# EAGLE design termoDaQ (EAGLE 9.1.3)
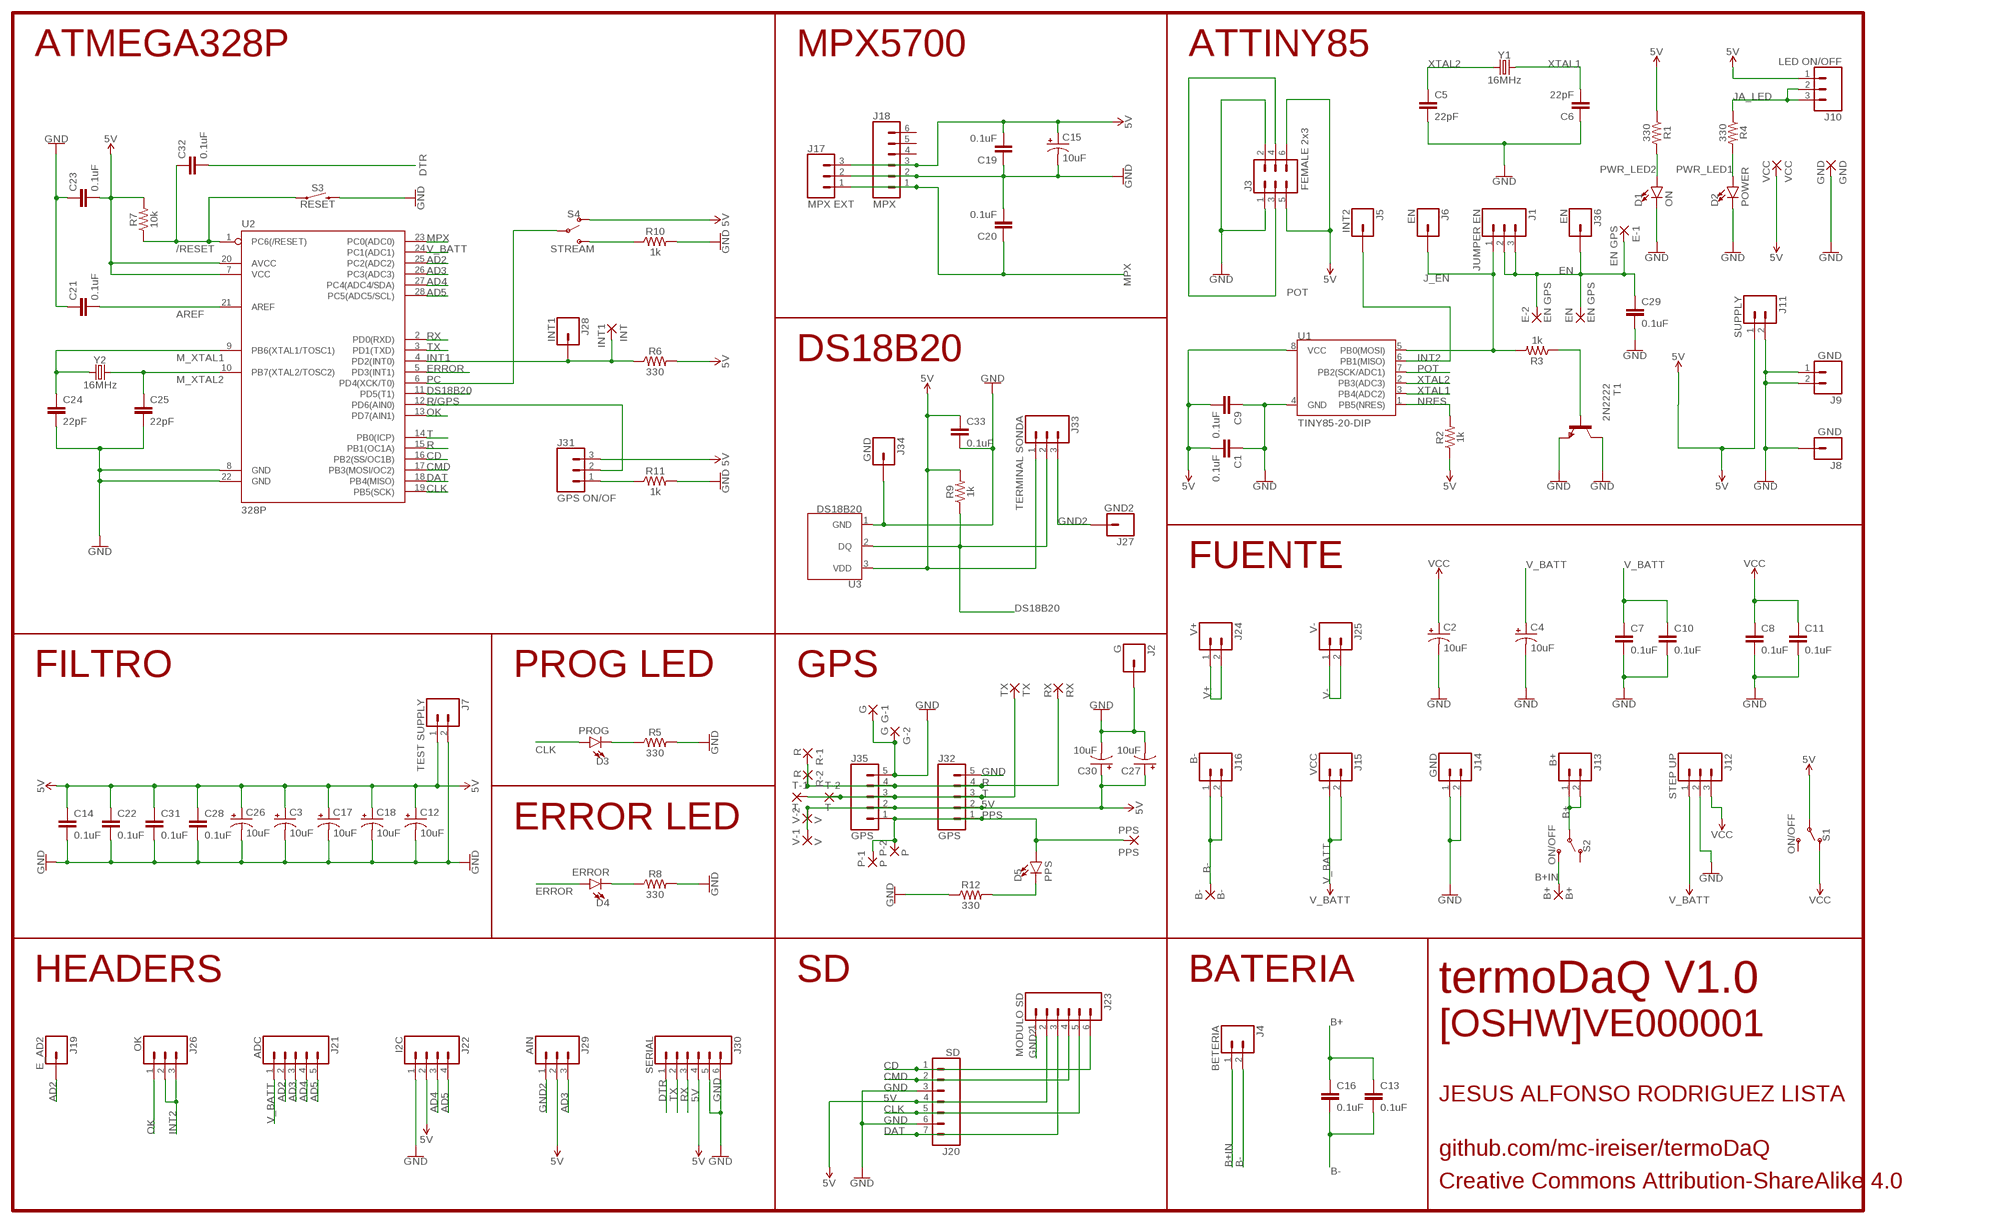
[diagram p0: schematic, sheet 1]

## Parts
B+  B+  SMD5  [SMD2,54-5,08]
B-  B-  SMD5  [SMD2,54-5,08]
C1  0.1uF  0.1UF-KIT-EZ-50V-20%  [CAP-PTH-SMALL-KIT]
C2  10uF  10UF-POLAR-RADIAL-2.5MM-25V-20%  [CPOL-RADIAL-2.5MM-5MM]
C3  10uF  10UF-POLAR-RADIAL-2.5MM-25V-20%  [CPOL-RADIAL-2.5MM-5MM]
C4  10uF  10UF-POLAR-RADIAL-2.5MM-25V-20%  [CPOL-RADIAL-2.5MM-5MM]
C5  22pF  22PF-PTH-2.54MM-200V-5%  [CAP-PTH-2.54]
C6  22pF  22PF-PTH-2.54MM-200V-5%  [CAP-PTH-2.54]
C7  0.1uF  0.1UF-KIT-EZ-50V-20%  [CAP-PTH-SMALL-KIT]
C8  0.1uF  0.1UF-KIT-EZ-50V-20%  [CAP-PTH-SMALL-KIT]
C9  0.1uF  0.1UF-KIT-EZ-50V-20%  [CAP-PTH-SMALL-KIT]
C10  0.1uF  0.1UF-KIT-EZ-50V-20%  [CAP-PTH-SMALL-KIT]
C11  0.1uF  0.1UF-KIT-EZ-50V-20%  [CAP-PTH-SMALL-KIT]
C12  10uF  10UF-POLAR-RADIAL-2.5MM-25V-20%  [CPOL-RADIAL-2.5MM-5MM]
C13  0.1uF  0.1UF-KIT-EZ-50V-20%  [CAP-PTH-SMALL-KIT]
C14  0.1uF  0.1UF-KIT-EZ-50V-20%  [CAP-PTH-SMALL-KIT]
C15  10uF  10UF-POLAR-RADIAL-2.5MM-25V-20%  [CPOL-RADIAL-2.5MM-5MM]
C16  0.1uF  0.1UF-KIT-EZ-50V-20%  [CAP-PTH-SMALL-KIT]
C17  10uF  10UF-POLAR-RADIAL-2.5MM-25V-20%  [CPOL-RADIAL-2.5MM-5MM]
C18  10uF  10UF-POLAR-RADIAL-2.5MM-25V-20%  [CPOL-RADIAL-2.5MM-5MM]
C19  0.1uF  0.1UF-KIT-EZ-50V-20%  [CAP-PTH-SMALL-KIT]
C20  0.1uF  0.1UF-KIT-EZ-50V-20%  [CAP-PTH-SMALL-KIT]
C21  0.1uF  0.1UF-KIT-EZ-50V-20%  [CAP-PTH-SMALL-KIT]
C22  0.1uF  0.1UF-KIT-EZ-50V-20%  [CAP-PTH-SMALL-KIT]
C23  0.1uF  0.1UF-KIT-EZ-50V-20%  [CAP-PTH-SMALL-KIT]
C24  22pF  22PF-PTH-2.54MM-200V-5%  [CAP-PTH-2.54]
C25  22pF  22PF-PTH-2.54MM-200V-5%  [CAP-PTH-2.54]
C26  10uF  10UF-POLAR-RADIAL-2.5MM-25V-20%  [CPOL-RADIAL-2.5MM-5MM]
C27  10uF  10UF-POLAR-RADIAL-2.5MM-25V-20%  [CPOL-RADIAL-2.5MM-5MM]
C28  0.1uF  0.1UF-KIT-EZ-50V-20%  [CAP-PTH-SMALL-KIT]
C29  0.1uF  0.1UF-KIT-EZ-50V-20%  [CAP-PTH-SMALL-KIT]
C30  10uF  10UF-POLAR-RADIAL-2.5MM-25V-20%  [CPOL-RADIAL-2.5MM-5MM]
C31  0.1uF  0.1UF-KIT-EZ-50V-20%  [CAP-PTH-SMALL-KIT]
C32  0.1uF  0.1UF-KIT-EZ-50V-20%  [CAP-PTH-SMALL-KIT]
C33  0.1uF  0.1UF-KIT-EZ-50V-20%  [CAP-PTH-SMALL-KIT]
D1  ON  LED5MM  [LED_5MM]
D2  POWER  LED3MM  [LED_3MM]
D3  PROG  LED5MM  [LED_5MM]
D4  ERROR  LED5MM  [LED_5MM]
D5  PPS  LED5MM  [LED_5MM]
E-1  EN GPS  SMD2  [SMD1,27-2,54]
E-2  EN GPS  SMD2  [SMD1,27-2,54]
EN  EN GPS  SMD2  [SMD1,27-2,54]
G-1  G  SMD2  [SMD1,27-2,54]
G-2  G  SMD2  [SMD1,27-2,54]
GND  GND  SMD2  [SMD1,27-2,54]
INT  INT1  SMD2  [SMD1,27-2,54]
J1  JUMPER EN  CONN_03  [1X03]
J2  G  CONN_01  [1X01]
J3  FEMALE 2x3  CONN_03X2FEMALE  [2X3]
J4  BETERIA  CONN_02  [1X02]
J5  INT2  CONN_01  [1X01]
J6  EN  CONN_01  [1X01]
J7  TEST SUPPLY  CONN_02  [1X02]
J8  GND  CONN_01  [1X01]
J9  GND  CONN_02  [1X02]
J10  LED ON/OFF  CONN_03  [1X03]
J11  SUPPLY  CONN_02  [1X02]
J12  STEP UP  CONN_03  [1X03]
J13  B+  CONN_02  [1X02]
J14  GND  CONN_02  [1X02]
J15  VCC  CONN_02  [1X02]
J16  B-  CONN_02  [1X02]
J17  MPX EXT  CONN_03  [1X03]
J18  MPX  CONN_06SILK_FEMALE_PTH  [1X06]
J19  E_AD2  CONN_01  [1X01]
J20  SD  CONN_07  [1X07]
J21  ADC  CONN_05  [1X05]
J22  I2C  CONN_04  [1X04]
J23  MODULO SD  CONN_06POLAR  [MOLEX-1X6]
J24  V+  CONN_02  [1X02]
J25  V-  CONN_02  [1X02]
J26  OK  CONN_03  [1X03]
J27  GND2  CONN_01  [1X01]
J28  INT1  CONN_01  [1X01]
J29  AIN  CONN_03  [1X03]
J30  SERIAL  CONN_06SILK_FEMALE_PTH  [1X06]
J31  GPS ON/OF  CONN_03  [1X03]
J32  GPS  CONN_05  [1X05]
J33  TERMINAL SONDA  CONN_03-SCREW-5MM  [SCREWTERMINAL-5MM-3]
J34  GND  CONN_01  [1X01]
J35  GPS  CONN_05  [1X05]
J36  EN  CONN_01  [1X01]
P-1  P  SMD2  [SMD1,27-2,54]
P-2  P  SMD2  [SMD1,27-2,54]
PPS  PPS  SMD2  [SMD1,27-2,54]
R1  330  330OHM-HORIZ-1/10W-5%  [AXIAL-0.3]
R2  1k  1KOHM-HORIZ-1/4W-1%  [AXIAL-0.3]
R3  1k  1KOHM-HORIZ-1/4W-1%  [AXIAL-0.3]
R4  330  330OHM-HORIZ-1/10W-5%  [AXIAL-0.3]
R5  330  330OHM-HORIZ-1/10W-5%  [AXIAL-0.3]
R6  330  330OHM-HORIZ-1/10W-5%  [AXIAL-0.3]
R7  10k  10KOHM-HORIZ-1/4W-5%  [AXIAL-0.3]
R8  330  330OHM-HORIZ-1/10W-5%  [AXIAL-0.3]
R9  1k  1KOHM-HORIZ-1/4W-1%  [AXIAL-0.3]
R10  1k  1KOHM-HORIZ-1/4W-1%  [AXIAL-0.3]
R11  1k  1KOHM-HORIZ-1/4W-1%  [AXIAL-0.3]
R12  330  330OHM-HORIZ-1/10W-5%  [AXIAL-0.3]
R-1  R  SMD2  [SMD1,27-2,54]
R-2  R  SMD2  [SMD1,27-2,54]
RX  RX  SMD2  [SMD1,27-2,54]
S1  ON/OFF  SWITCH-SPDT-PTH-11.6X4.0MM  [SWITCH_SPDT_PTH_11.6X4.0MM]
S2  ON/OFF  SWITCH-SPDT-PTH-11.6X4.0MM  [SWITCH_SPDT_PTH_11.6X4.0MM]
S3  RESET  MOMENTARY-SWITCH-SPST-PTH-6.0MM  [TACTILE_SWITCH_PTH_6.0MM]
S4  STREAM  SWITCH-SPDT-PTH-11.6X4.0MM  [SWITCH_SPDT_PTH_11.6X4.0MM]
T1  2N2222  [TO92-EBC-OVAL]
T-1  T  SMD2  [SMD1,27-2,54]
T-2  T  SMD2  [SMD1,27-2,54]
TX  TX  SMD2  [SMD1,27-2,54]
U1  TINY85-20-DIP  ATTINY45TINY85-20-DIP  [DIP08_MCU]
U2  328P  ATMEGA328P_PDIP  [DIP28]
U3  DS18B20  [TO-92-AMMO]
V-1  V  SMD2  [SMD1,27-2,54]
V-2  V  SMD2  [SMD1,27-2,54]
VCC  VCC  SMD2  [SMD1,27-2,54]
Y1  16MHz  CRYSTAL-16MHZPTH-HC49US  [HC49US]
Y2  16MHz  CRYSTAL-16MHZPTH-HC49US  [HC49US]

## Nets
5V: C1.2 C3.1(+) C9.2 C12.1(+) C14.1 C15.1(+) C17.1(+) C18.1(+) C19.2 C22.1 C23.2 C26.1(+) C27.1(+) C28.1 C30.1(+) C31.1 C33.1 J3.5 J3.6 J7.1 J10.1 J11.1 J17.3 J18.3 J20.4 J22.2 J23.2 J29.2 J30.4 J31.3 J32.2 J33.1 J35.2 R1.P$1 R2.P$1 R6.P$2 R7.P$2 R9.P$2 S1.2(P) S4.1(O) U1.8(VCC) U2.7(VCC) U2.20(AVCC) U3.3(VDD) V-1.1(P) V-2.1(P) VCC.1(P)
/RESET: C32.1 R7.P$1 S3.1 U2.1(PC6(/RESET))
AD2: J19.1 J21.2 U2.25(PC2(ADC2))
AD3: J21.3 J29.3 U2.26(PC3(ADC3))
AD4: J21.4 J22.3 U2.27(PC4(ADC4/SDA))
AD5: J21.5 J22.4 U2.28(PC5(ADC5/SCL))
AREF: C21.2 U2.21(AREF)
B+: C13.1 C16.1 J13.1 J13.2 S2.2(P)
B+IN: B+.1(P) J4.1 S2.3(S)
B-: B-.1(P) C13.2 C16.2 J4.2 J16.1 J16.2
CD: J20.1 J23.6 U2.16(PB2(SS/OC1B))
CLK: D3.A J20.5 J23.5 U2.19(PB5(SCK))
CMD: J20.2 J23.4 U2.17(PB3(MOSI/OC2))
DAT: J20.7 J23.3 U2.18(PB4(MISO))
DS18B20: J33.2 R9.P$1 U2.11(PD5(T1)) U3.2(DQ)
DTR: C32.2 J30.1
EN: C29.1 E-1.1(P) E-2.1(P) EN.1(P) J1.2 J1.3 J36.1
ERROR: D4.A U2.5(PD3(INT1))
GND: C1.1 C2.2(-) C3.2(-) C4.2(-) C5.2 C6.1 C7.2 C8.2 C9.1 C10.2 C11.2 C12.2(-) C14.2 C15.2(-) C17.2(-) C18.2(-) C19.1 C20.2 C21.1 C22.2 C23.1 C24.2 C25.2 C26.2(-) C27.2(-) C28.2 C29.2 C30.2(-) C31.2 C33.2 D1.K(C) D2.K(C) G-1.1(P) G-2.1(P) GND.1(P) J2.1 J3.1 J3.2 J7.2 J8.1 J9.1 J9.2 J11.2 J12.2 J14.1 J14.2 J17.2 J18.2 J20.3 J20.6 J22.1 J30.5 J30.6 J32.5 J34.1 J35.5 R5.P$2 R8.P$2 R10.P$2 R11.P$2 R12.P$1 S3.3 T1.C T1.E U1.4(GND) U2.8(GND) U2.22(GND) U3.1(GND)
GND2: J23.1 J27.1 J29.1 J33.3
INT1: INT.1(P) J28.1 R6.P$1 U2.4(PD2(INT0))
INT2: J5.1 J26.2 J26.3 U1.6(PB1(MISO))
J_EN: J1.1 J6.1 R3.P$2 U1.5(PB0(MOSI))
JA_LED: J10.2 J10.3 R4.P$1
M_XTAL1: C24.1 U2.9(PB6(XTAL1/TOSC1)) Y2.1
M_XTAL2: C25.1 U2.10(PB7(XTAL2/TOSC2)) Y2.2
MPX: C20.1 J17.1 J18.1 U2.23(PC0(ADC0))
N$5: D3.K(C) R5.P$1
N$8: D5.K(C) R12.P$2
N$12: D4.K(C) R8.P$1
N$16: J31.1 R11.P$1
N$17: R10.P$1 S4.3(S)
N$20: R3.P$1 T1.B
NRES: R2.P$2 U1.1(PB5(NRES))
OK: J26.1 U2.13(PD7(AIN1))
PC: S4.2(P) U2.6(PD4(XCK/T0))
POT: J3.3 J3.4 U1.7(PB2(SCK/ADC1))
PPS: D5.A J32.1 J35.1 P-1.1(P) P-2.1(P) PPS.1(P)
PWR_LED1: D2.A R4.P$2
PWR_LED2: D1.A R1.P$2
R: J32.4 J35.4 R-1.1(P) R-2.1(P) RX.1(P) U2.15(PB1(OC1A))
R/GPS: J31.2 U2.12(PD6(AIN0))
RX: J30.3 U2.2(PD0(RXD))
T: J32.3 J35.3 T-1.1(P) T-2.1(P) TX.1(P) U2.14(PB0(ICP))
TX: J30.2 U2.3(PD1(TXD))
V+: J24.1 J24.2
V-: J25.1 J25.2
V_BATT: C4.1(+) C7.1 C10.1 J12.1 J15.1 J15.2 J21.1 U2.24(PC1(ADC1))
VCC: C2.1(+) C8.1 C11.1 J12.3 S1.1(O)
XTAL1: C6.2 U1.3(PB4(ADC2)) Y1.2
XTAL2: C5.1 U1.2(PB3(ADC3)) Y1.1
Unconnected: J18.4 J18.5 J18.6 S1.3(S) S2.1(O)

## Notes on the sheet
- ATMEGA328P | MPX5700 | ATTINY85
- DS18B20
- FUENTE
- FILTRO | PROG LED | GPS
- ERROR LED
- HEADERS | SD | BATERIA | termoDaQ V1.0
- [OSHW]VE000001
- JESUS ALFONSO RODRIGUEZ LISTA
- github.com/mc-ireiser/termoDaQ
- Creative Commons Attribution-ShareAlike 4.0

## Library data of the parts
B+ B- = wirepad:SMD5: SMD PAD
C1 C7-C11 C13 C14 C16 C19-C23 C28 C29 C31-C33 = SparkFun-Capacitors:0.1UF: 0.1µF ceramic capacitors A capacitor is a passive two-terminal electrical component used to store electrical energy temporarily in an electric field.; PROD_ID: CAP-08370
C2-C4 C12 C15 C17 C18 C26 C27 C30 = SparkFun-Capacitors:10UF-POLAR: 10.0µF polarized capacitors A capacitor is a passive two-terminal electrical component used to store electrical energy temporarily in an electric field.; PROD_ID: CAP-08440
C5 C6 C24 C25 = SparkFun-Capacitors:22PF: 22pF ceramic capacitors A capacitor is a passive two-terminal electrical component used to store electrical energy temporarily in an electric field.; PROD_ID: CAP-09128
D1 D3-D5 = SparkFun-LED:LED: LED (Generic) Standard schematic elements and footprints for 5mm, 3mm, 1206, and 0603 sized LEDs. Generic LEDs with no color specified.
D2 = SparkFun-LED:LED: LED (Generic) Standard schematic elements and footprints for 5mm, 3mm, 1206, and 0603 sized LEDs. Generic LEDs with no color specified.; PROD_ID: DIO-08794
E-1 E-2 EN G-1 G-2 GND INT P-1 P-2 PPS R-1 R-2 RX T-1 T-2 TX V-1 V-2 VCC = wirepad:SMD2: SMD PAD
J1 J10 J12 J17 J26 J29 J31 = SparkFun-Connectors:CONN_03: Multi connection point. Often used as Generic Header-pin footprint for 0.1 inch spaced/style header connections On any of the 0.1 inch spaced packages, you can populate with these: Break Away Headers - Straight <https://www.sparkfun.com/products/116> (PRT-00116) Break Away Male Headers - Right Angle <https://www.sparkfun.com/products/553> (PRT-00553) Female Headers <https://www.sparkfun.com/products/115> (PRT-00115) Break Away Headers - Machine Pin <https://www.sparkfun.com/products/117> (PRT-00117) Break Away Female Headers - Swiss Machine Pin <https://www.sparkfun.com/products/743> (PRT-00743) Stackable Header - 3 Pin (Female, 0.1") <https://www.sparkfun.com/products/13875> (PRT-13875) For SCREWTERMINALS and SPRING TERMINALS visit here: Screw Terimnals on SparkFun.com <https://www.sparkfun.com/search/results?term=Screw+Terminals> (5mm/3.5mm/2.54mm spacing) This device is also useful as a general connection point to wire up your design to another part of your project. Our various solder wires solder well into these plated through hole pads. Hook-Up Wire - Assortment (Stranded, 22 AWG) <https://www.sparkfun.com/products/11375> (PRT-11375) Hook-Up Wire - Assortment (Solid Core, 22 AWG) <https://www.sparkfun.com/products/11367> (PRT-11367) View the entire wire category on our website here <https://www.sparkfun.com/categories/141> Special notes: Molex polarized connector foot print use with SKU : PRT-08232 with associated crimp pins and housings.
J2 J5 J6 J8 J19 J27 J28 J34 J36 = SparkFun-Connectors:CONN_01: Single connection point. Often used as Generic Header-pin footprint for 0.1 inch spaced/style header connections On any of the 0.1 inch spaced packages, you can populate with these: Break Away Headers - Straight <https://www.sparkfun.com/products/116> (PRT-00116) Break Away Male Headers - Right Angle <https://www.sparkfun.com/products/553> (PRT-00553) Female Headers <https://www.sparkfun.com/products/115> (PRT-00115) Break Away Headers - Machine Pin <https://www.sparkfun.com/products/117> (PRT-00117) Break Away Female Headers - Swiss Machine Pin <https://www.sparkfun.com/products/743> (PRT-00743) This device is also useful as a general connection point to wire up your design to another part of your project. Our various solder wires solder well into these plated through hole pads. Hook-Up Wire - Assortment (Stranded, 22 AWG) <https://www.sparkfun.com/products/11375> (PRT-11375) Hook-Up Wire - Assortment (Solid Core, 22 AWG) <https://www.sparkfun.com/products/11367> (PRT-11367) View the entire wire category on our website here <https://www.sparkfun.com/categories/141> Special notes: SMTSO-256-ET is a "flush mount" nut for a 4-40 screw. We mostly use this on specialty testbeds; it is a nice way to connect hardware to your PCB at an adjustable hieght. Also note, the SNAP packages are for using a snappable style connector. We sell a baggie of snaps and they are also used on two LilyPad designs: Snap Assortment - 30 pack (male and female) <https://www.sparkfun.com/products/11347> (DEV-11347) LilyPad Arduino SimpleSnap <https://www.sparkfun.com/products/10941> (DEV-10941) LilyPad SimpleSnap Protoboard <https://www.sparkfun.com/products/10940> (DEV-10940)
J3 = SparkFun-Connectors:CONN_03X2: Multi connection point. Often used as Generic Header-pin footprint for 0.1 inch spaced/style header connections You can populate with any combo of single row headers, but if you'd like an exact match, check these: Header - 2x3 (Male, 0.1") <https://www.sparkfun.com/products/12807> (PRT-12807) Header - 2x3 (Female, 0.1") <https://www.sparkfun.com/products/13010> (PRT-13010) 2x3 Pin Shrouded Header <https://www.sparkfun.com/products/10877> (PRT-10877) On any of the 0.1 inch spaced packages, you can populate with these: Break Away Headers - Straight <https://www.sparkfun.com/products/116> (PRT-00116) Break Away Male Headers - Right Angle <https://www.sparkfun.com/products/553> (PRT-00553) Female Headers <https://www.sparkfun.com/products/115> (PRT-00115) Break Away Headers - Machine Pin <https://www.sparkfun.com/products/117> (PRT-00117) Break Away Female Headers - Swiss Machine Pin <https://www.sparkfun.com/products/743> (PRT-00743) Special note: the shrouded connector mates well with our 3x2 ribbon cables: Ribbon Crimp Connector - 6-pin (2x3, Female) <https://www.sparkfun.com/products/10651> (PRT-10651) Ribbon Cable - 6 wire (15ft) <https://www.sparkfun.com/products/10646> (PRT-10646); PROD_ID: CONN-11566
J4 J7 J9 J11 J13-J16 J24 J25 = SparkFun-Connectors:CONN_02: Multi connection point. Often used as Generic Header-pin footprint for 0.1 inch spaced/style header connections On any of the 0.1 inch spaced packages, you can populate with these: Break Away Headers - Straight <https://www.sparkfun.com/products/116> (PRT-00116) Break Away Male Headers - Right Angle <https://www.sparkfun.com/products/553> (PRT-00553) Female Headers <https://www.sparkfun.com/products/115> (PRT-00115) Break Away Headers - Machine Pin <https://www.sparkfun.com/products/117> (PRT-00117) Break Away Female Headers - Swiss Machine Pin <https://www.sparkfun.com/products/743> (PRT-00743) For SCREWTERMINALS and SPRING TERMINALS visit here: Screw Terimnals on SparkFun.com <https://www.sparkfun.com/search/results?term=Screw+Terminals> (5mm/3.5mm/2.54mm spacing) This device is also useful as a general connection point to wire up your design to another part of your project. Our various solder wires solder well into these plated through hole pads. Hook-Up Wire - Assortment (Stranded, 22 AWG) <https://www.sparkfun.com/products/11375> (PRT-11375) Hook-Up Wire - Assortment (Solid Core, 22 AWG) <https://www.sparkfun.com/products/11367> (PRT-11367) View the entire wire category on our website here <https://www.sparkfun.com/categories/141> Special notes: Molex polarized connector foot print use with: PRT-08233 with associated crimp pins and housings. 2.54_SCREWTERM for use with PRT-10571. 3.5mm Screw Terminal footprints for PRT-08084 5mm Screw Terminal footprints for use with PRT-08432
J18 J30 = SparkFun-Connectors:CONN_06: Multi connection point. Often used as Generic Header-pin footprint for 0.1 inch spaced/style header connections On any of the 0.1 inch spaced packages, you can populate with these: Break Away Headers - Straight <https://www.sparkfun.com/products/116> (PRT-00116) Break Away Male Headers - Right Angle <https://www.sparkfun.com/products/553> (PRT-00553) Female Headers <https://www.sparkfun.com/products/115> (PRT-00115) Break Away Headers - Machine Pin <https://www.sparkfun.com/products/117> (PRT-00117) Break Away Female Headers - Swiss Machine Pin <https://www.sparkfun.com/products/743> (PRT-00743) Arduino Stackable Header - 6 Pin <https://www.sparkfun.com/products/9280> (PRT-09280) For SCREWTERMINALS and SPRING TERMINALS visit here: Screw Terimnals on SparkFun.com <https://www.sparkfun.com/search/results?term=Screw+Terminals> (5mm/3.5mm/2.54mm spacing) This device is also useful as a general connection point to wire up your design to another part of your project. Our various solder wires solder well into these plated through hole pads. Hook-Up Wire - Assortment (Stranded, 22 AWG) <https://www.sparkfun.com/products/11375> (PRT-11375) Hook-Up Wire - Assortment (Solid Core, 22 AWG) <https://www.sparkfun.com/products/11367> (PRT-11367) View the entire wire category on our website here <https://www.sparkfun.com/categories/141>; PROD_ID: CONN-08437
J20 = SparkFun-Connectors:CONN_07: Multi connection point. Often used as Generic Header-pin footprint for 0.1 inch spaced/style header connections On any of the 0.1 inch spaced packages, you can populate with these: Break Away Headers - Straight <https://www.sparkfun.com/products/116> (PRT-00116) Break Away Male Headers - Right Angle <https://www.sparkfun.com/products/553> (PRT-00553) Female Headers <https://www.sparkfun.com/products/115> (PRT-00115) Break Away Headers - Machine Pin <https://www.sparkfun.com/products/117> (PRT-00117) Break Away Female Headers - Swiss Machine Pin <https://www.sparkfun.com/products/743> (PRT-00743) For SCREWTERMINALS and SPRING TERMINALS visit here: Screw Terimnals on SparkFun.com <https://www.sparkfun.com/search/results?term=Screw+Terminals> (5mm/3.5mm/2.54mm spacing) This device is also useful as a general connection point to wire up your design to another part of your project. Our various solder wires solder well into these plated through hole pads. Hook-Up Wire - Assortment (Stranded, 22 AWG) <https://www.sparkfun.com/products/11375> (PRT-11375) Hook-Up Wire - Assortment (Solid Core, 22 AWG) <https://www.sparkfun.com/products/11367> (PRT-11367) View the entire wire category on our website here <https://www.sparkfun.com/categories/141> Special notes: Molex polarized connector foot print use with SKU : PRT-08231 with associated crimp pins and housings. 1MM SMD Version SKU: PRT-10208 NOTES ON THE VARIANTS LOCK and LOCK_LONGPADS... This footprint was designed to help hold the alignment of a through-hole component (i.e. 6-pin header) while soldering it into place. You may notice that each hole has been shifted either up or down by 0.005 of an inch from it's more standard position (which is a perfectly straight line). This slight alteration caused the pins (the squares in the middle) to touch the edges of the holes. Because they are alternating, it causes a "brace" to hold the component in place. 0.005 has proven to be the perfect amount of "off-center" position when using our standard breakaway headers. Although looks a little odd when you look at the bare footprint, once you have a header in there, the alteration is very hard to notice. Also,if you push a header all the way into place, it is covered up entirely on the bottom side.
J21 J32 J35 = SparkFun-Connectors:CONN_05: Multi connection point. Often used as Generic Header-pin footprint for 0.1 inch spaced/style header connections On any of the 0.1 inch spaced packages, you can populate with these: Break Away Headers - Straight <https://www.sparkfun.com/products/116> (PRT-00116) Break Away Male Headers - Right Angle <https://www.sparkfun.com/products/553> (PRT-00553) Female Headers <https://www.sparkfun.com/products/115> (PRT-00115) Break Away Headers - Machine Pin <https://www.sparkfun.com/products/117> (PRT-00117) Break Away Female Headers - Swiss Machine Pin <https://www.sparkfun.com/products/743> (PRT-00743) For SCREWTERMINALS and SPRING TERMINALS visit here: Screw Terimnals on SparkFun.com <https://www.sparkfun.com/search/results?term=Screw+Terminals> (5mm/3.5mm/2.54mm spacing) This device is also useful as a general connection point to wire up your design to another part of your project. Our various solder wires solder well into these plated through hole pads. Hook-Up Wire - Assortment (Stranded, 22 AWG) <https://www.sparkfun.com/products/11375> (PRT-11375) Hook-Up Wire - Assortment (Solid Core, 22 AWG) <https://www.sparkfun.com/products/11367> (PRT-11367) View the entire wire category on our website here <https://www.sparkfun.com/categories/141> Special notes: Molex polarized connector foot print use with SKU : PRT-08231 with associated crimp pins and housings. 1MM SMD Version SKU: PRT-10208
J22 = SparkFun-Connectors:CONN_04: Multi connection point. Often used as Generic Header-pin footprint for 0.1 inch spaced/style header connections On any of the 0.1 inch spaced packages, you can populate with these: Break Away Headers - Straight <https://www.sparkfun.com/products/116> (PRT-00116) Break Away Male Headers - Right Angle <https://www.sparkfun.com/products/553> (PRT-00553) Female Headers <https://www.sparkfun.com/products/115> (PRT-00115) Break Away Headers - Machine Pin <https://www.sparkfun.com/products/117> (PRT-00117) Break Away Female Headers - Swiss Machine Pin <https://www.sparkfun.com/products/743> (PRT-00743) For SCREWTERMINALS and SPRING TERMINALS visit here: Screw Terimnals on SparkFun.com <https://www.sparkfun.com/search/results?term=Screw+Terminals> (5mm/3.5mm/2.54mm spacing) This device is also useful as a general connection point to wire up your design to another part of your project. Our various solder wires solder well into these plated through hole pads. Hook-Up Wire - Assortment (Stranded, 22 AWG) <https://www.sparkfun.com/products/11375> (PRT-11375) Hook-Up Wire - Assortment (Solid Core, 22 AWG) <https://www.sparkfun.com/products/11367> (PRT-11367) View the entire wire category on our website here <https://www.sparkfun.com/categories/141> Special notes: Molex polarized connector foot print use with SKU : PRT-08231 with associated crimp pins and housings. 1MM SMD Version SKU: PRT-10208; PROD_ID: CONN-09696
J23 = SparkFun-Connectors:CONN_06: Multi connection point. Often used as Generic Header-pin footprint for 0.1 inch spaced/style header connections On any of the 0.1 inch spaced packages, you can populate with these: Break Away Headers - Straight <https://www.sparkfun.com/products/116> (PRT-00116) Break Away Male Headers - Right Angle <https://www.sparkfun.com/products/553> (PRT-00553) Female Headers <https://www.sparkfun.com/products/115> (PRT-00115) Break Away Headers - Machine Pin <https://www.sparkfun.com/products/117> (PRT-00117) Break Away Female Headers - Swiss Machine Pin <https://www.sparkfun.com/products/743> (PRT-00743) Arduino Stackable Header - 6 Pin <https://www.sparkfun.com/products/9280> (PRT-09280) For SCREWTERMINALS and SPRING TERMINALS visit here: Screw Terimnals on SparkFun.com <https://www.sparkfun.com/search/results?term=Screw+Terminals> (5mm/3.5mm/2.54mm spacing) This device is also useful as a general connection point to wire up your design to another part of your project. Our various solder wires solder well into these plated through hole pads. Hook-Up Wire - Assortment (Stranded, 22 AWG) <https://www.sparkfun.com/products/11375> (PRT-11375) Hook-Up Wire - Assortment (Solid Core, 22 AWG) <https://www.sparkfun.com/products/11367> (PRT-11367) View the entire wire category on our website here <https://www.sparkfun.com/categories/141>
J33 = SparkFun-Connectors:CONN_03: Multi connection point. Often used as Generic Header-pin footprint for 0.1 inch spaced/style header connections On any of the 0.1 inch spaced packages, you can populate with these: Break Away Headers - Straight <https://www.sparkfun.com/products/116> (PRT-00116) Break Away Male Headers - Right Angle <https://www.sparkfun.com/products/553> (PRT-00553) Female Headers <https://www.sparkfun.com/products/115> (PRT-00115) Break Away Headers - Machine Pin <https://www.sparkfun.com/products/117> (PRT-00117) Break Away Female Headers - Swiss Machine Pin <https://www.sparkfun.com/products/743> (PRT-00743) Stackable Header - 3 Pin (Female, 0.1") <https://www.sparkfun.com/products/13875> (PRT-13875) For SCREWTERMINALS and SPRING TERMINALS visit here: Screw Terimnals on SparkFun.com <https://www.sparkfun.com/search/results?term=Screw+Terminals> (5mm/3.5mm/2.54mm spacing) This device is also useful as a general connection point to wire up your design to another part of your project. Our various solder wires solder well into these plated through hole pads. Hook-Up Wire - Assortment (Stranded, 22 AWG) <https://www.sparkfun.com/products/11375> (PRT-11375) Hook-Up Wire - Assortment (Solid Core, 22 AWG) <https://www.sparkfun.com/products/11367> (PRT-11367) View the entire wire category on our website here <https://www.sparkfun.com/categories/141> Special notes: Molex polarized connector foot print use with SKU : PRT-08232 with associated crimp pins and housings.; PROD_ID: CONN-10134; SF_SKU: PRT-08433
R1 R4-R6 R8 R12 = SparkFun-Resistors:330OHM: 330Ω resistor A resistor is a passive two-terminal electrical component that implements electrical resistance as a circuit element. Resistors act to reduce current flow, and, at the same time, act to lower voltage levels within circuits. - Wikipedia; PROD_ID: RES-8371
R2 R3 R9 R11 = SparkFun-Resistors:1KOHM: 1kΩ resistor A resistor is a passive two-terminal electrical component that implements electrical resistance as a circuit element. Resistors act to reduce current flow, and, at the same time, act to lower voltage levels within circuits. - Wikipedia; PROD_ID: RES-12182
R7 = SparkFun-Resistors:10KOHM: 10kΩ resistor A resistor is a passive two-terminal electrical component that implements electrical resistance as a circuit element. Resistors act to reduce current flow, and, at the same time, act to lower voltage levels within circuits. - Wikipedia; PROD_ID: RES-09435
R10 = SparkFun-Resistors:1KOHM: 1kΩ resistor A resistor is a passive two-terminal electrical component that implements electrical resistance as a circuit element. Resistors act to reduce current flow, and, at the same time, act to lower voltage levels within circuits. - Wikipedia; PROD_ID: RES-12182; SPICEPREFIX: R
S1 S2 = SparkFun-Switches:SWITCH-SPDT: Single Pole, Double Throw (SPDT) Switch Single-pole, double-throw (SPDT) switch. Variant Overview SMD-AYZ0202 Surface Mount DPDT Switch <https://www.sparkfun.com/products/597> (COM-00597) Used on e.g. LilyPad Arduino USB - ATmega32U4 Board <https://www.sparkfun.com/products/12049> PTH-11.6X4.0MM SPDT Mini Power Switch <https://www.sparkfun.com/products/102> (COM-00102) Used on e.g. SparkFun Simon Says - Through-Hole Soldering Kit <https://www.sparkfun.com/products/10547> (KIT-10547) PTH-11.6X4.0MM-KIT KIT version of SPDT Mini Power Switch - Simplifies soldering by removing tStop of switch pins - only one side can be soldered. PTH-11.6X4.0MM-LOCK LOCK version of SPDT Mini Power Switch - Offset pins hold switch in place for easier soldering. SMD-RIGHT-ANGLE Surface Mount Right Angle Switch <https://www.sparkfun.com/products/10860> (COM-10860) Used on e.g. SparkFun ESP8266 Thing <https://www.sparkfun.com/products/13231>; PROD_ID: SWCH-08261; SF_SKU: COM-00102
S3 = SparkFun-Switches:MOMENTARY-SWITCH-SPST: Momentary Switch (Pushbutton) - SPST Normally-open (NO) SPST momentary switches (buttons, pushbuttons). Variants PTH-12MM - 12mm square, through-hole Momentary Pushbutton Switch - 12mm Square <https://www.sparkfun.com/products/9190> (COM-09190) PTH-6.0MM, PTH-6.0MM-KIT - 6.0mm square, through-hole Mini Pushbutton Switch <https://www.sparkfun.com/products/97> (COM-00097) KIT package intended for soldering kit's - only one side of pads' copper is exposed. PTH-RIGHT-ANGLE-KIT - Right-angle, through-hole Right Angle Tactile Button <https://www.sparkfun.com/products/10791> - Used on SparkFun BigTime Watch Kit <https://www.sparkfun.com/products/11734> SMD-12MM - 12mm square, surface-mount Tactile Button - SMD (12mm) <https://www.sparkfun.com/products/12993> (COM-12993) Used on SparkFun PicoBoard <https://www.sparkfun.com/products/11888> SMD-4.5MM - 4.5mm Square Trackball Switch Used on SparkFun Blackberry Trackballer Breakout <https://www.sparkfun.com/products/13169> SMD-4.6MMX2.8MM - 4.60mm x 2.80mm, surface mount Used on SparkFun SAMD21 Mini Breakout <https://www.sparkfun.com/products/13664> SMD-5.2MM, SMD-5.2-REDUNDANT - 5.2mm square, surface-mount Mini Pushbutton Switch - SMD <https://www.sparkfun.com/products/8720> (COM-08720) Used on Arduino Pro Mini <https://www.sparkfun.com/products/11114> REDUNDANT package connects both switch circuits together SMD-6.0X3.5MM - 6.0 x 3.5mm, surface mount Momentary Reset Switch SMD <https://www.sparkfun.com/products/8229> (COM-08229) SMD-6.2MM-TALL - 6.2mm square, surface mount Tactile Button - SMD (6mm) <https://www.sparkfun.com/products/12992> Used on SparkFun Digital Sandbox <https://www.sparkfun.com/products/12651> SMD-RIGHT-ANGLE - Right-angle, surface mount Used on SparkFun Block for Intel® Edison - Arduino <https://www.sparkfun.com/products/13036>; PROD_ID: SWCH-08441; SF_SKU: COM-00097
S4 = SparkFun-Switches:SWITCH-SPDT: Single Pole, Double Throw (SPDT) Switch Single-pole, double-throw (SPDT) switch. Variant Overview SMD-AYZ0202 Surface Mount DPDT Switch <https://www.sparkfun.com/products/597> (COM-00597) Used on e.g. LilyPad Arduino USB - ATmega32U4 Board <https://www.sparkfun.com/products/12049> PTH-11.6X4.0MM SPDT Mini Power Switch <https://www.sparkfun.com/products/102> (COM-00102) Used on e.g. SparkFun Simon Says - Through-Hole Soldering Kit <https://www.sparkfun.com/products/10547> (KIT-10547) PTH-11.6X4.0MM-KIT KIT version of SPDT Mini Power Switch - Simplifies soldering by removing tStop of switch pins - only one side can be soldered. PTH-11.6X4.0MM-LOCK LOCK version of SPDT Mini Power Switch - Offset pins hold switch in place for easier soldering. SMD-RIGHT-ANGLE Surface Mount Right Angle Switch <https://www.sparkfun.com/products/10860> (COM-10860) Used on e.g. SparkFun ESP8266 Thing <https://www.sparkfun.com/products/13231>; PROD_ID: SWCH-08261; SF_SKU: COM-00102; SPICEPREFIX: J
T1 = adafruit:2N2222: NPN TRANSISTOR Big oval pads
U1 = SparkFun-Retired:ATTINY45: Atmel 8-pin 2/4/8kB flash uC Retired; PROD_ID: IC-09445
U2 = SparkFun-IC-Microcontroller:ATMEGA328P_PDIP: Atmel 328P Through hole ATMEGA328P uC used in the Arduino 32kb flash, 1k EEPROM, 2k SRAM Datasheet <http://www.sparkfun.com/datasheets/Components/SMD/ATMega328.pdf> SparkFun Products Storefront component: AVR 28 Pin 20MHz 32K 6A/D - ATMega328P <https://www.sparkfun.com/products/9061> (COM-09061) SparkFun Simon Says - Through-Hole Soldering Kit <https://www.sparkfun.com/products/10547> (KIT-10547) SparkFun Learn to Solder - Simon Says <https://www.sparkfun.com/products/13708> (KIT-13708) SparkFun BigTime Watch Kit <https://www.sparkfun.com/products/11734> (KIT-11734) SparkFun ClockIt <https://www.sparkfun.com/products/10930> (KIT-10930) SparkFun Serial Enabled LCD Kit <https://www.sparkfun.com/products/10097> (LCD-10097) SparkFun Simon Tilts - Through Hole Soldering Kit <https://www.sparkfun.com/products/12634> (KIT-12634) SparkFun Frequency Counter Kit <https://www.sparkfun.com/products/10140> (KIT-10140) FabFM Radio Kit <https://www.sparkfun.com/products/11043> (KIT-11043) SparkFun Binary Blaster Kit <https://www.sparkfun.com/products/12037> (KIT-12037) SparkFun Metro-Gnome <https://www.sparkfun.com/products/9236> (KIT-09236) ATmega328 with Arduino Optiboot (Uno) <https://www.sparkfun.com/products/10524> (DEV-10524); PROD_ID: IC-09136
U3 = SparkFun-Sensors:DS18B20: Dallas/Maxim DS18B20 1-Wire Temperature Sensor The DS18B20 reports degrees C with 9 to 12-bit precision, -55C to 125C (+/-0.5C). Each sensor has a unique 64-Bit Serial number etched into it - allows for a huge number of sensors to be used on one data bus. Datasheet <http://datasheets.maximintegrated.com/en/ds/DS18B20.pdf> SparkFun Products One Wire Digital Temperature Sensor - DS18B20 <https://www.sparkfun.com/products/245> (SEN-00245); STORE_ID: SEN-00245
Y1 Y2 = SparkFun-Clocks:CRYSTAL-16MHZ: 16MHz Crystal Digikey Example <http://www.digikey.com/product-search/en?keywords=535-9122-1-ND> Frequency: 16MHz Frequency Stability: ±50ppm Frequency Tolerance: ±20ppm Load Capacitance: 18pF SparkFun Products: Pro Micro -5V/16MHz <https://www.sparkfun.com/products/12640> SparkFun Serial Enabled LCD Kit <https://www.sparkfun.com/products/10097>; PROD_ID: XTAL-08181; SF_ID: COM-00536

## Board
termoDaQ v.1.0 Jesús Rodríguez [OSHW] VE000001
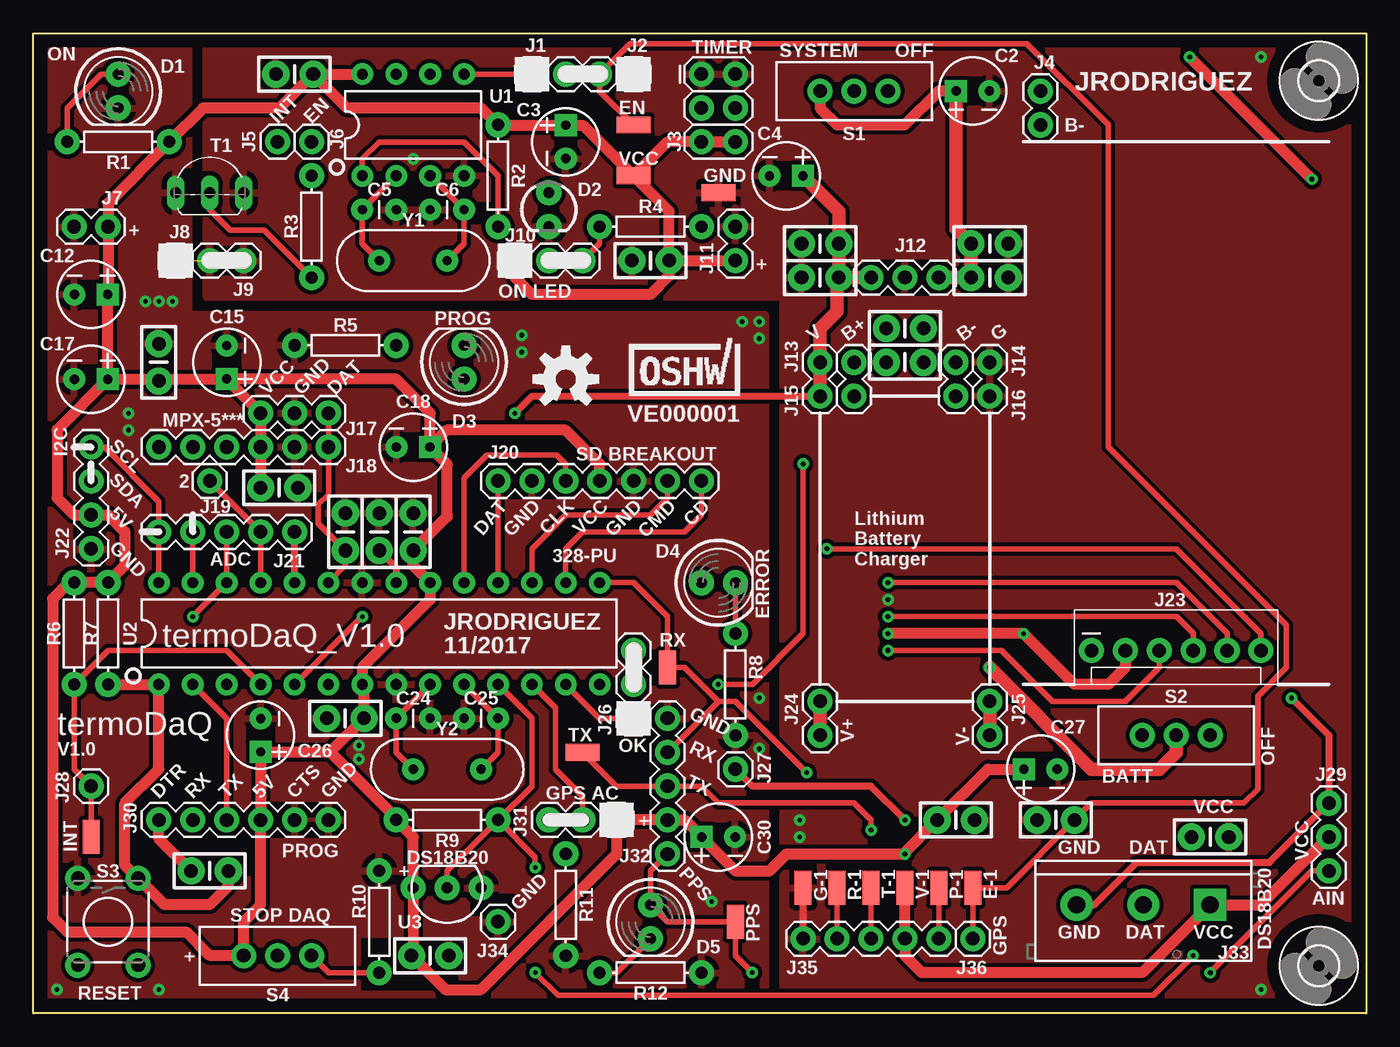
[diagram p1: board, top side]
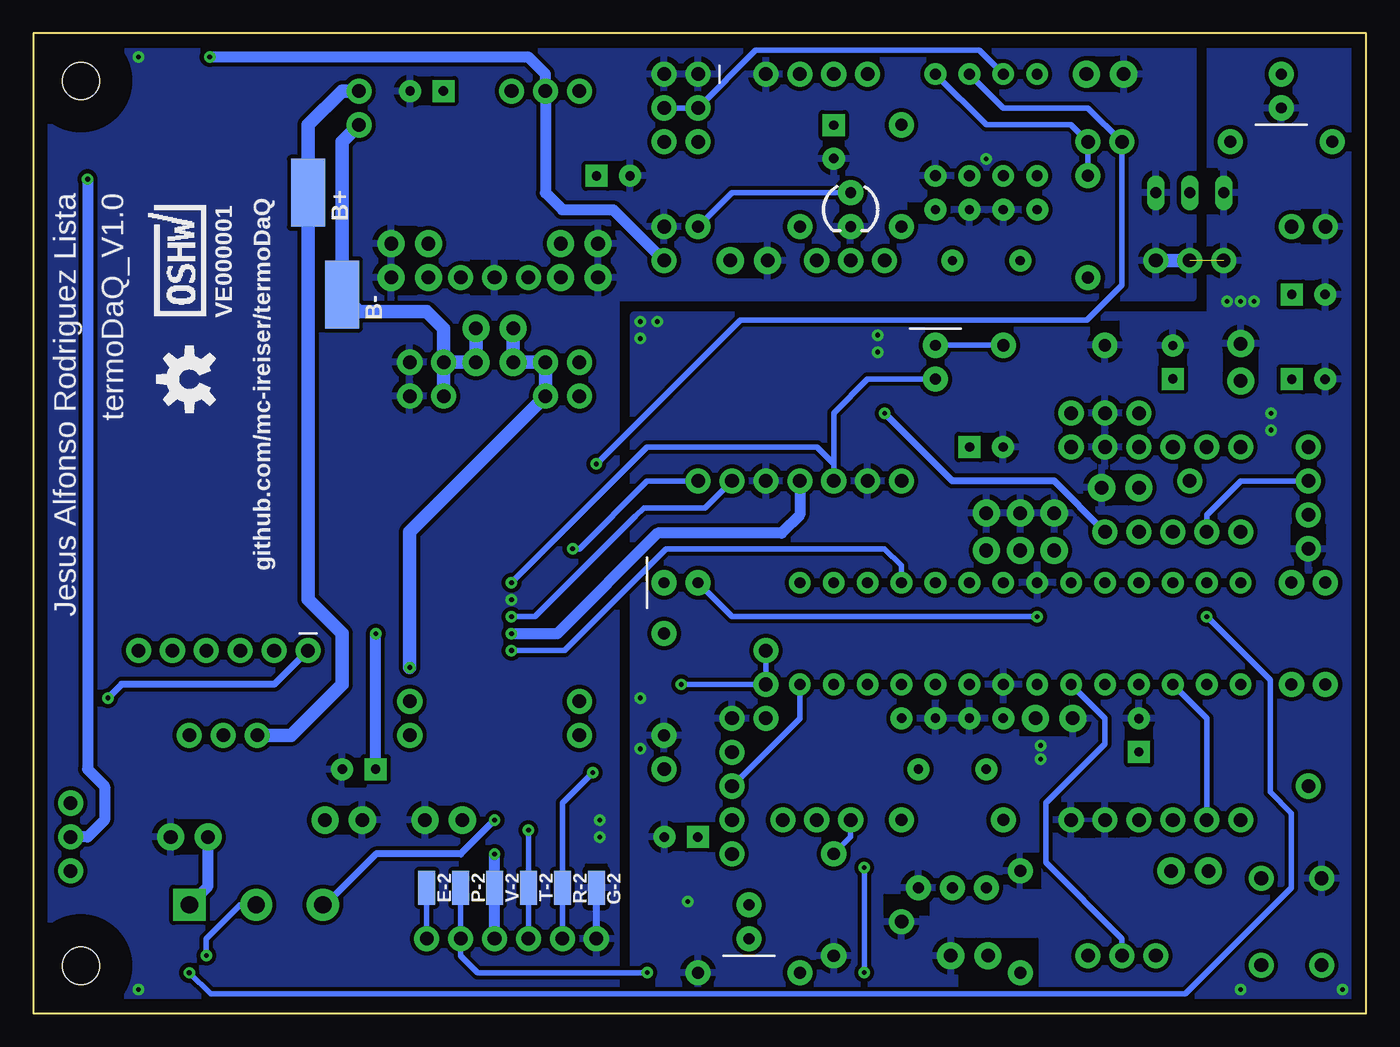
[diagram p2: board, bottom side, seen from below]

Size 99.82 x 73.41 mm. Coordinates in mm from the lower left corner, seen from the top.
Outline: 0,0 0,73.41 99.82,73.41 99.82,0 0,0
Copper layers (1*16): Top 0.035mm / dielectric 1.5mm / Bottom 0.035mm
Design rules "SeeedStudio_2layer_DRU_no_angle_20140221 *": minimum track width 10mil, minimum drill 12mil, track to track 6mil, track to pad 6mil, pad to pad 6mil, via to via 6mil, smd to smd 0mil, copper to edge 10mil, drill to drill 10mil, minimum pad ring 10mil, minimum via ring 10mil, stop-mask expansion 2mil, vias tented up to drill 100mil, thermal gap 16mil

### Footprints (pad centres in the part's own frame; a part is rotated, then mirrored left to right if it is on the bottom)
SMD2,54-5,08 = smd 2.54 x 5.08: 1 0,0
CAP-PTH-SMALL-KIT = drill 1.016 pad 2.032: 1 -1.397,0; 2 1.397,0
CPOL-RADIAL-2.5MM-5MM = drill 0.7 pad 1.651 square: 1 1.25,0 | drill 0.7 pad 1.651: 2 -1.25,0
CAP-PTH-2.54 = drill 0.7 pad 1.651: 1 -1.27,0; 2 1.27,0
LED_5MM = drill 0.813 pad 1.88: A -1.27,0; K 1.27,0
LED_3MM = drill 0.813 pad 1.88: A -1.27,0; K 1.27,0
SMD1,27-2,54 = smd 1.27 x 2.54: 1 0,0
1X03 = drill 1.016 pad 1.88: 1 0,0; 2 2.54,0; 3 5.08,0
1X01 = drill 1.016 pad 1.88: 1 0,0
2X3 = drill 1.016 pad 1.88: 1 0,0; 2 0,2.54; 3 2.54,0; 4 2.54,2.54; 5 5.08,0; 6 5.08,2.54
1X02 = drill 1.016 pad 1.88: 1 0,0; 2 2.54,0
1X06 = drill 1.016 pad 1.88: 1 0,0; 2 2.54,0; 3 5.08,0; 4 7.62,0; 5 10.16,0; 6 12.7,0
1X07 = drill 1.016 pad 1.88: 1 0,0; 2 2.54,0; 3 5.08,0; 4 7.62,0; 5 10.16,0; 6 12.7,0; 7 15.24,0
1X05 = drill 1.016 pad 1.88: 1 0,0; 2 2.54,0; 3 5.08,0; 4 7.62,0; 5 10.16,0
1X04 = drill 1.016 pad 1.88: 1 0,0; 2 2.54,0; 3 5.08,0; 4 7.62,0
MOLEX-1X6 = drill 1.016 pad 1.88: 1 0,0; 2 2.54,0; 3 5.08,0; 4 7.62,0; 5 10.16,0; 6 12.7,0
SCREWTERMINAL-5MM-3 = drill 1.3 pad 2.413 square: 1 0,0 | drill 1.3 pad 2.413: 2 5,0; 3 10,0
AXIAL-0.3 = drill 0.9 pad 1.88: P$1 -3.81,0; P$2 3.81,0
SWITCH_SPDT_PTH_11.6X4.0MM = drill 1.016 pad 1.88: 1 0,2.54; 2 0,0; 3 0,-2.54
TACTILE_SWITCH_PTH_6.0MM = drill 1.016 pad 1.88: 1 -3.251,2.261; 2 3.251,2.261; 3 -3.251,-2.261; 4 3.251,-2.261
TO92-EBC-OVAL = drill 0.813 long: B 0,-1.27; C 2.54,-1.27; E -2.54,-1.27
DIP08_MCU = drill 0.813 pad 1.626: 1 -3.81,-3.81; 2 -1.27,-3.81; 3 1.27,-3.81; 4 3.81,-3.81; 5 3.81,3.81; 6 1.27,3.81; 7 -1.27,3.81; 8 -3.81,3.81
DIP28 = drill 0.813 pad 1.626: 1 -16.51,-3.81; 2 -13.97,-3.81; 3 -11.43,-3.81; 4 -8.89,-3.81; 5 -6.35,-3.81; 6 -3.81,-3.81; 7 -1.27,-3.81; 8 1.27,-3.81; 9 3.81,-3.81; 10 6.35,-3.81; 11 8.89,-3.81; 12 11.43,-3.81; 13 13.97,-3.81; 14 16.51,-3.81; 15 16.51,3.81; 16 13.97,3.81; 17 11.43,3.81; 18 8.89,3.81; 19 6.35,3.81; 20 3.81,3.81; 21 1.27,3.81; 22 -1.27,3.81; 23 -3.81,3.81; 24 -6.35,3.81; 25 -8.89,3.81; 26 -11.43,3.81; 27 -13.97,3.81; 28 -16.51,3.81
TO-92-AMMO = drill 0.813 pad 1.88: 1 -2.54,0; 2 0,0; 3 2.54,0
2,8 = hole 2.8: 0,0
HC49US = drill 0.7 pad 1.651: 1 -2.54,0; 2 2.54,0

### Placement (x,y rotation side)
B+  79.25,61.47 0 bottom
B-  76.71,53.85 0 bottom
C1  19.56,70.36 0 top
C2  70.36,69.09 180 top
C3  39.88,65.28 90 top
C4  56.39,62.74 0 top
C5  25.91,60.2 0 top
C6  30.99,60.2 0 top
C7  58.93,57.66 180 top
C8  71.63,57.66 0 top
C9  46.23,56.39 0 top
C10  58.93,55.12 180 top
C11  71.63,55.12 0 top
C12  4.32,53.85 0 top
C13  65.28,51.31 0 top
C14  9.4,48.77 90 top
C15  14.48,48.77 270 top
C16  65.28,48.77 0 top
C17  4.32,47.5 0 top
C18  28.45,42.42 0 top
C19  18.41,39.37 180 top
C20  23.37,36.07 90 top
C21  25.91,36.07 270 top
C22  28.45,36.07 90 top
C23  23.37,22.1 0 top
C24  28.45,22.1 0 top
C25  33.53,22.1 180 top
C26  17.02,20.83 270 top
C27  75.44,18.29 180 top
C28  69.09,14.48 0 top
C29  76.58,14.48 180 top
C30  51.31,13.21 180 top
C31  88.14,13.21 0 top
C32  13.21,10.67 180 top
C33  29.72,4.32 0 top
D1  6.35,69.09 270 top
D2  38.61,60.2 270 top
D3  32.26,48.77 90 top
D4  51.31,32.26 0 top
D5  46.23,6.86 270 top
E-1  70.36,9.4 180 top
E-2  70.36,9.4 180 bottom
EN  44.96,66.55 270 top
G-1  57.66,9.4 180 top
G-2  57.66,9.4 180 bottom
GND  51.31,61.47 270 top
INT  4.32,13.21 0 top
J1  37.34,70.36 0 top
J2  44.96,70.36 0 top
J3  50.04,70.36 270 top
J4  75.44,69.09 270 top
J5  18.29,65.28 0 top
J6  20.83,65.28 0 top
J7  5.59,58.93 180 top
J8  10.67,56.39 90 top
J9  15.75,56.39 180 top
J10  36.07,56.39 0 top
J11  52.58,56.39 90 top
J12  62.74,55.12 0 top
J13  61.47,48.77 270 top
J14  71.63,48.77 270 top
J15  58.93,46.23 90 top
J16  69.09,46.23 90 top
J17  22.1,44.96 180 top
J18  22.1,42.42 180 top
J19  13.21,39.88 180 top
J20  50.04,39.88 180 top
J21  19.56,36.07 180 top
J22  4.32,34.8 90 top
J23  79.25,27.18 0 top
J24  58.93,23.37 270 top
J25  71.63,23.37 270 top
J26  44.96,22.1 90 top
J27  52.58,18.29 270 top
J28  4.32,17.02 180 top
J29  97.03,15.75 270 top
J30  9.4,14.48 0 top
J31  38.61,14.48 0 top
J32  47.5,11.94 90 top
J33  88.14,8.13 180 top
J34  34.8,6.86 180 top
J35  67.82,5.59 180 top
J36  70.36,5.59 0 top
P-1  67.82,9.4 180 top
P-2  67.82,9.4 180 bottom
PPS  52.58,6.86 180 top
R1  6.35,65.28 180 top
R2  34.8,62.74 270 top
R3  20.83,58.93 90 top
R4  46.23,58.93 0 top
R5  23.37,50.04 180 top
R6  3.05,28.45 90 top
R7  5.59,28.45 90 top
R8  52.58,24.64 270 top
R9  30.99,14.48 180 top
R10  25.91,6.86 90 top
R11  39.88,8.13 270 top
R12  46.23,3.05 180 top
R-1  60.2,9.4 180 top
R-2  60.2,9.4 180 bottom
RX  47.5,25.91 180 top
S1  61.47,69.09 90 top
S2  85.6,20.83 270 top
S3  5.59,6.86 270 top
S4  18.29,4.32 90 top
T1  13.21,62.74 0 top
T-1  62.74,9.4 180 top
T-2  62.74,9.4 180 bottom
TX  41.15,19.56 270 top
U1  28.45,66.55 0 top
U2  25.91,28.45 0 top
U3  30.99,9.4 180 top
U$1  [OSHW-LOGO-M]  39.88,47.5 0 top
U$2  [CERT-SMALL-SILK]  48.77,46.23 0 top
U$3  [2,8]  96.27,69.85 0 top
U$4  [2,8]  96.27,3.56 0 top
U$100  [OSHW-LOGO-M]  88.14,47.5 90 bottom
U$101  [CERT-SMALL-SILK]  86.87,56.39 90 bottom
V-1  65.28,9.4 180 top
V-2  65.28,9.4 180 bottom
VCC  44.96,62.74 270 top
Y1  28.45,56.39 0 top
Y2  30.99,18.29 0 top

### Tracks (layer width: path | path; a pad name or v marks a point on that pad's centre or on a via)
5V  (via drill 0.35)
  Top 0.813: J3.6 J3.5 47.5,65.28 VCC.1 | C17.1 C12.1 5.59,53.87 J7.1 5.59,60.71 R1.P$1 12.7,67.82 18.54,67.82 18.54,67.94 C1.2 | 14.5,47.5 C15.1 | v64.01,28.45 v74.17,28.45 77.98,24.64 80.52,24.64 81.79,25.91 J23.2 | VCC.1 41.17,66.53 C3.1 34.82,66.53 R2.P$1 33.53,67.82 23.5,67.82 C1.2 | C17.1 1.78,43.71 1.78,38.61 3.05,37.34 J22.2 5.59,37.34 6.86,36.07 6.86,33.53 R7.P$2 R6.P$2 2.67,32.26 1.45,31.04 1.45,7.19 2.54,6.1 11.43,6.1 13.21,4.32 S4.1 15.75,6.86 17.02,8.13 J30.4 C26.1 22.25,19.58 | C17.1 9.27,47.5 C14.1 9.53,47.5 14.5,47.5 | C18.1 30.99,41.13 30.99,37.34 30.99,37.21 C22.1 28.45,33.53 U2.20 29.72,30.99 24.64,25.91 U2.7 24.77,24.51 C23.2 22.25,19.58 | C18.1 30.97,43.69 39.88,43.69 42.42,41.15 J20.4 | 14.5,47.5 14.5,47.48 J17.3 J18.3 C19.2 | C27.1 71.5,18.29 C28.1 65.15,11.94 56.39,11.94 55.12,10.67 52.6,10.67 C30.1 48.79,14.48 J32.2 J31.3 43.69,11.94 33.53,1.78 30.86,1.78 C33.1 28.45,4.45 U3.3 28.45,13.21 R9.P$2 27.18,14.64 22.25,19.58 | J29.2 91.95,8.13 J33.1 83.06,3.05 66.55,3.05 65.28,4.32 J35.2 V-1.1 | v95.76,62.48 v86.61,71.63 | C9.2 J11.1 | C1.2 U1.8 | C9.2 47.62,60.07 VCC.1 | C9.2 47.62,55.24 46.23,53.85 37.34,53.85 36.07,55.12 J10.1 | C18.1 29.72,42.44 29.72,44.96 27.18,47.5 14.5,47.5
  Bottom 0.813: v64.01,28.45 60.58,28.45 53.06,35.97 43.79,35.97 42.42,37.34 J20.4 | J35.2 V-1.1 v65.28,11.94 | J33.1 86.74,9.53 C31.1 | v74.17,28.45 74.19,28.43 C27.1 | J29.2 95.76,13.21 94.49,14.48 94.49,17.02 95.76,18.29 v95.76,62.48 | v86.61,71.63 62.74,71.63 61.47,70.36 S1.2 61.47,61.47 60.2,60.2 56.39,60.2 J11.1
/RESET
  Top 0.813: R7.P$1 U2.1 9.4,18.29 6.86,15.75 6.86,11.1 S3.1 9.83,8.13 13.21,8.13 14.61,9.53 C32.1
AD2
  Top 0.406: U2.25 J21.2 J19.1
AD3  (via drill 0.35)
  Top 0.406: J21.3 U2.26 v11.94,29.72 | J29.3 95.76,10.67 88.15,3.06 v88.15,3.04
  Bottom 0.406: 86.56,1.45 86.11,1.45 | 86.11,1.45 13.54,1.45 5.59,9.4 5.59,14.99 7.19,16.59 7.19,18.36 7.19,24.97 v11.94,29.72 | v88.15,3.04 86.56,1.45 | 86.56,1.45 86.11,1.45
AD4
  Top 0.406: U2.27 J21.4
  Bottom 0.406: J21.4 11.94,37.34 9.4,39.88 J22.3
AD5
  Top 0.406: U2.28 J21.5 9.4,38.35 5.33,42.42 J22.4
AREF
  Top 0.508: C21.2 27.18,33.4 U2.21
B+  (via drill 0.35)
  Top 1.016: S2.2 85.6,19.56 84.33,18.29 79.25,18.29 v71.63,25.91
  Bottom 1.016: v71.63,25.91 71.63,36.07 J13.2 J13.1 C16.1 C13.1
B+IN
  Bottom 1.016: J4.1 76.71,69.09 79.25,66.55 B+.1 79.25,30.99 76.71,28.45 76.71,24.64 80.52,20.83 S2.3
B-
  Bottom 1.016: J4.2 76.71,65.28 B-.1 75.44,52.58 73.91,52.58 72.9,52.58 | J16.2 J16.1 | J16.2 C16.2 C13.2 | 72.9,52.58 | 72.9,52.58 70.36,52.58 69.09,51.31 J16.2
CD  (via drill 0.35)
  Top 0.406: v59.44,34.8 85.6,34.8 91.95,28.45 J23.6 | U2.16 39.88,34.8 41.15,36.07 48.77,36.07 50.04,37.34 J20.1
  Bottom 0.406: J20.1 53.85,39.88 58.93,34.8 v59.44,34.8
CLK  (via drill 0.35)
  Top 0.406: J23.5 89.41,28.45 85.6,32.26 v64.01,32.26 | U2.19 32.26,38.61 32.26,39.62 | 32.26,39.62 32.26,39.88 | 32.26,39.88 32.26,40.1 | 32.26,39.88 32.26,39.62 | 32.26,40.1 33.99,41.83 39.19,41.83 39.88,41.15 J20.5 | 32.26,40.1 32.26,39.88
  Bottom 0.406: v64.01,32.26 53.85,42.42 41.15,42.42 39.88,41.15 J20.5 39.88,44.96 37.34,47.5 D3.A
CMD  (via drill 0.35)
  Top 0.406: J23.4 86.87,28.45 85.6,29.72 69.09,29.72 67.82,29.72 65.28,29.72 v64.01,29.72 | U2.17 37.34,34.8 39.88,37.34 46.23,37.34 47.5,38.61 J20.2
  Bottom 0.406: v64.01,29.72 62.23,29.72 54.71,37.24 54.1,37.85 49.53,37.85 J20.2
DAT  (via drill 0.35)
  Top 0.406: J23.3 84.33,25.91 81.79,23.37 76.33,23.37 72.52,27.18 69.09,27.18 67.82,27.18 v64.01,27.18 | U2.18 J20.7
  Bottom 0.406: v64.01,27.18 60.2,27.18 60.05,27.18 52.43,34.8 36.07,34.8 34.8,33.53 U2.18
DS18B20  (via drill 0.35)
  Top 0.406: R9.P$1 37.34,17.02 37.34,19.81 37.34,22.1 U2.11 | v86.87,4.32 83.9,1.35 39.37,1.35 39.29,1.35 v37.59,3.05 | R9.P$1 37.59,11.68 v37.59,10.92 | R9.P$1 30.99,10.67 U3.2
  Bottom 0.406: v37.59,10.92 v37.59,3.05 | v86.87,4.32 86.87,5.59 84.33,8.13 J33.2
DTR
  Top 0.813: C32.2 9.4,13.08 J30.1
EN
  Top 0.406: J1.2 J1.3 | J36.1 E-1.1 72.9,9.4 C29.1 79.25,15.75 90.68,15.75 91.69,16.76 91.69,23.75 93.85,25.91 93.85,29.08 80.52,42.42 80.52,66.55 74.42,72.64 44.7,72.64 J1.3 | J1.3 42.42,69.09 EN.1
  Bottom 0.406: E-1.1 J36.1
ERROR  (via drill 0.35)
  Top 0.406: U2.5 v24.64,29.72
  Bottom 0.406: D4.A 47.5,29.72 v24.64,29.72
GND  (via drill 0.35)  (1 unrouted)
  Top 0.508: G-1.1 J35.5
  Bottom 0.508: J35.5 G-1.1
  Bottom 1.016: J9.1 J9.2
  other vias: 64.01,30.99 9.4,1.78 91.95,1.78 91.95,71.63 1.78,1.78 8.38,53.34 9.4,53.34 10.41,53.34 57.4,14.48 57.4,13.21 50.8,8.38 24.38,20.07 24.38,19.05 36.58,50.8 36.58,49.53 28.45,64.01 53.09,51.82 54.36,51.82 54.36,50.55 7.11,43.69 7.11,44.96 54.36,23.62 54.36,19.81
  pour Bottom (isolate 0.305): 0.51,72.9 0.51,0.51 54.86,0.51 54.86,52.32 11.68,52.32 11.68,72.9
  pour Bottom (isolate 0.305): 12.95,53.59 12.95,72.9 99.31,72.9 99.31,0.51 56.13,0.51 56.13,53.59
  pour Top (isolate 0.305): 11.68,52.32 11.68,72.9 0.51,72.9 0.51,0.51 54.86,0.51 54.86,52.32
  pour Top (isolate 0.305): 56.13,0.51 56.13,53.59 12.95,53.59 12.95,72.9 99.31,72.9 99.31,0.51
GND2  (via drill 0.35)
  Top 0.508: J33.3 79.48,8.13 82.66,11.3 92.58,11.3 J29.1 97.03,20.83 v94.23,23.62 | J27.1 53.85,17.02 62.74,17.02 v65.28,14.48
  Bottom 0.508: J23.1 81.79,24.64 93.22,24.64 v94.23,23.62 | v65.28,14.48 67.82,11.94 74.17,11.94 77.98,8.13 J33.3
GND-CUT
  cutout Top: 69.85,68.07 69.85,70.1 71.12,70.1 71.12,68.07
  cutout Top: 42.93,71.63 42.93,69.09 44.45,69.09 44.45,71.63
  cutout Top: 39.12,65.79 40.64,65.79 40.64,64.77 39.12,64.77
  cutout Bottom: 39.12,65.79 40.64,65.79 40.64,64.77 39.12,64.77
  cutout Bottom: 69.85,70.1 69.85,68.07 71.12,68.07 71.12,70.1
  cutout Bottom: 37.85,60.96 37.85,59.44 39.37,59.44 39.37,60.96
INT1
  Top 0.406: 14.48,27.18 13.21,27.18 | 13.21,27.18 7.62,27.18 | 7.62,27.18 5.59,27.18 | INT.1 J28.1 3.05,18.29 R6.P$1 5.59,27.18 | 14.48,27.18 13.21,27.18 | 5.59,27.18 7.62,27.18 | U2.4 14.48,27.18
INT2  (via drill 0.35)
  Top 0.406: v51.31,24.64 53.85,24.64 57.66,28.45 v57.66,41.15
  Bottom 0.406: J26.3 J26.2 v51.31,24.64 | U1.6 27.18,67.82 20.83,67.82 J5.1 18.29,54.56 20.9,51.94 46.86,51.94 v57.66,41.15
J_EN
  Top 0.406: U1.5 J1.1
  Bottom 0.406: R3.P$2 J6.1 22.1,66.55 28.45,66.55 U1.5
JA_LED
  Top 0.406: J10.2 J10.3 42.42,57.66 R4.P$1
M_XTAL1
  Top 0.406: U2.9 C24.1 | 27.18,19.56 C24.1 | C24.1 27.18,19.56 | 27.18,19.56 Y2.1
M_XTAL2
  Top 0.406: U2.10 C25.1 | C25.1 34.8,19.56 | C25.1 34.8,19.56 | 34.8,19.56 Y2.2
MPX
  Top 0.406: J17.1 J18.1 22.1,38.86 21.34,38.1 21.34,36.7 C20.1 23.37,33.53 U2.23
N$1
  cutout Top: 37.85,60.96 37.85,59.44 39.37,59.44 39.37,60.96
N$2
  cutout Top: 11.18,63.25 11.18,59.94 12.19,59.94 12.19,63.25
N$3
  cutout Bottom: 11.18,63.25 12.19,63.25 12.19,59.94 11.18,59.94
N$4
  cutout Bottom: 11.43,57.4 11.43,55.37 12.7,55.37 12.7,57.4
N$5
  Bottom 0.406: R5.P$1 D3.K
N$6
  cutout Top: 11.43,57.4 12.7,57.4 12.7,55.37 11.43,55.37
N$7
  cutout Top: 18.8,71.63 18.8,69.09 20.32,69.09 20.32,71.63
N$8
  Top 0.406: R12.P$2 43.69,3.05 D5.K
N$9
  cutout Bottom: 18.8,71.63 18.8,69.09 20.32,69.09 20.32,71.63
N$10
  cutout Bottom: 56.9,11.18 56.9,10.41 58.42,10.41 58.42,11.18
N$11
  cutout Top: 56.9,11.18 56.9,10.41 58.42,10.41 58.42,11.18
N$12
  Top 0.406: R8.P$1 D4.K
N$13
  cutout Top: 32.77,60.71 32.77,59.18 34.29,59.18 34.29,60.71
N$14
  cutout Bottom: 32.77,60.71 32.77,59.18 34.29,59.18 34.29,60.71
N$15
  cutout Top: 22.35,23.62 22.35,20.83 25.91,20.83 25.91,23.62
N$16
  Bottom 0.406: R11.P$1 38.61,13.21 J31.1
N$17
  Top 0.406: S4.3 22.1,3.05 R10.P$1
N$18
  cutout Bottom: 22.35,23.62 22.35,20.83 25.91,20.83 25.91,23.62
N$19
  cutout Bottom: 16,20.32 16,21.59 18.03,21.59 18.03,20.32
N$20
  Top 0.406: R3.P$1 17.27,58.67 14.73,58.67 13.21,60.2 T1.B
N$21
  cutout Top: 16,20.32 16,21.59 18.03,21.59 18.03,20.32
N$22
  cutout Top: 17.78,15.75 17.78,13.21 18.8,13.21 18.8,15.75
N$23
  cutout Bottom: 17.78,15.75 17.78,13.21 18.8,13.21 18.8,15.75
N$24
  cutout Bottom: 20.32,14.73 21.34,14.73 21.34,15.75 20.32,15.75
N$25
  cutout Bottom: 20.32,14.22 21.34,14.22 21.34,13.21 20.32,13.21
N$26
  cutout Top: 20.32,14.73 20.32,15.75 21.34,15.75 21.34,14.73
N$27
  cutout Top: 20.32,14.22 20.32,13.21 21.34,13.21 21.34,14.22
N$28
  cutout Bottom: 53.34,2.79 53.34,1.78 54.36,1.78 54.36,2.79
N$29
  cutout Top: 53.34,2.79 53.34,1.78 54.36,1.78 54.36,2.79
N$30
  cutout Top: 73.41,19.56 76.96,19.56 76.96,18.8 76.45,18.8 76.45,17.02 73.41,17.02
N$31
  cutout Bottom: 74.93,19.05 76.45,19.05 76.45,17.02 74.93,17.02
N$32
  cutout Top: 77.22,19.05 77.22,17.53 78.99,17.53 78.99,19.05
N$33
  cutout Top: 75.95,15.49 75.95,13.46 77.22,13.46 77.22,15.49
N$34
  cutout Bottom: 75.95,15.49 75.95,13.46 77.22,13.46 77.22,15.49
N$35
  cutout Bottom: 68.33,15.49 68.33,13.46 69.85,13.46 69.85,15.49
N$36
  cutout Top: 68.33,15.49 68.33,13.46 69.85,13.46 69.85,15.49
N$37
  cutout Top: 87.38,14.48 87.38,11.94 88.9,11.94 88.9,14.48
N$38
  cutout Bottom: 87.38,14.48 87.38,11.94 88.9,11.94 88.9,14.48
N$39
  cutout Bottom: 56.9,63.75 56.9,61.72 55.63,61.72 55.63,63.75
N$40
  cutout Top: 55.63,63.75 55.63,61.72 56.9,61.72 56.9,63.75
N$41
  cutout Top: 5.59,69.85 5.59,68.33 7.11,68.33 7.11,69.85
N$42
  cutout Bottom: 5.59,69.85 5.59,68.33 7.11,68.33 7.11,69.85
N$43
  cutout Bottom: 3.81,60.2 3.81,57.66 4.83,57.66 4.83,60.2
N$44
  cutout Top: 3.81,60.2 3.81,57.66 4.83,57.66 4.83,60.2
N$45
  cutout Top: 3.81,54.86 3.81,52.83 4.83,52.83 4.83,54.86
N$46
  cutout Bottom: 3.81,54.86 3.81,52.83 4.83,52.83 4.83,54.86
N$47
  cutout Bottom: 3.56,48.51 3.56,46.48 4.83,46.48 4.83,48.51
N$48
  cutout Top: 3.56,48.51 3.56,46.48 4.83,46.48 4.83,48.51
N$49
  cutout Top: 8.13,49.53 10.67,49.53 10.67,48.01 8.13,48.01
N$50
  cutout Bottom: 8.13,49.53 10.67,49.53 10.67,48.01 8.13,48.01
N$51
  cutout Bottom: 13.46,49.53 15.49,49.53 15.49,48.01 13.46,48.01
N$52
  cutout Top: 13.46,49.53 15.49,49.53 15.49,48.01 13.46,48.01
N$53
  cutout Top: 17.78,40.64 17.78,38.1 19.05,38.1 19.05,40.64
N$54
  cutout Bottom: 17.78,40.64 17.78,38.1 19.05,38.1 19.05,40.64
N$55
  cutout Bottom: 3.05,36.58 5.59,36.58 5.59,35.56 3.05,35.56
N$56
  cutout Top: 3.05,36.58 5.33,36.58 5.33,35.56 3.05,35.56
N$57
  cutout Top: 35.56,41.4 35.56,38.61 36.58,38.61 36.58,41.4
N$58
  cutout Top: 38.1,41.4 38.1,38.61 39.12,38.61 39.12,41.4
N$59
  cutout Top: 36.58,41.4 38.1,41.4 38.1,40.64 36.58,40.64
N$60
  cutout Top: 1.78,11.18 2.79,11.18 2.79,8.89 1.78,8.89
N$61
  cutout Top: 24.64,5.59 29.72,5.59 29.72,1.78 24.64,1.78
N$62
  cutout Bottom: 24.64,5.59 24.64,1.78 30.48,1.78 30.48,5.59
N$63
  cutout Bottom: 29.21,5.59 29.21,3.05 30.23,3.05 30.23,5.59
N$64
  cutout Top: 29.21,5.59 29.21,3.05 30.48,3.05 30.48,5.59
N$65
  cutout Top: 30.48,3.56 31.75,3.56 31.75,2.54 30.48,2.54
N$66
  cutout Bottom: 25.65,11.94 25.65,9.4 24.38,9.4 24.38,11.94
N$67
  cutout Bottom: 18.54,50.8 20.57,50.8 20.57,51.82 18.54,51.82
N$68
  cutout Bottom: 13.72,57.4 13.72,55.37 14.99,55.37 14.99,57.4
N$69
  cutout Top: 13.72,57.4 13.72,55.37 14.99,55.37 14.99,57.4
N$70
  cutout Top: 50.8,14.22 52.07,14.22 52.07,12.19 50.8,12.19
N$71
  cutout Bottom: 50.8,14.22 50.8,12.19 52.07,12.19 52.07,14.22
N$72
  cutout Bottom: 46.74,21.34 46.74,20.32 48.26,20.32 48.26,21.34
N$73
  cutout Top: 46.74,21.34 46.74,20.32 48.26,20.32 48.26,21.34
N$74
  cutout Top: 45.72,21.08 45.72,23.11 46.74,23.11 46.74,21.08
N$79
  cutout Bottom: 63.5,56.39 63.5,53.85 64.52,53.85 64.52,56.39
N$80
  cutout Bottom: 66.04,56.39 66.04,53.85 67.06,53.85 67.06,56.39
N$81
  cutout Top: 63.5,56.39 63.5,53.85 64.52,53.85 64.52,56.39
N$82
  cutout Top: 66.04,56.39 66.04,53.85 67.06,53.85 67.06,56.39
N$83
  cutout Top: 71.12,58.93 71.12,53.85 72.39,53.85 72.39,58.93
N$84
  cutout Bottom: 71.12,58.93 71.12,53.85 72.39,53.85 72.39,58.93
N$85
  cutout Bottom: 58.17,58.93 58.17,53.85 59.44,53.85 59.69,53.85 59.69,58.93
N$86
  cutout Top: 58.17,58.93 58.17,53.85 59.69,53.85 59.69,58.93
N$87
  cutout Top: 45.47,57.66 45.47,55.12 46.99,55.12 46.99,57.66
N$88
  cutout Bottom: 45.47,57.66 45.47,55.12 46.99,55.12 46.99,57.66
N$91
  cutout Bottom: 25.65,60.96 32.77,60.96 32.77,61.98 25.65,61.98
N$93
  cutout Top: 25.65,60.96 25.65,61.98 32.77,61.98 32.77,60.96
N$95
  cutout Top: 1.02,0.51 1.02,72.9 0.51,72.9 0.51,0.51
N$96
  cutout Bottom: 1.02,0.51 1.02,72.9 0.51,72.9 0.51,0.51
N$97
  cutout Bottom: 98.81,0.51 98.81,72.9 99.31,72.9 99.31,0.51
N$98
  cutout Top: 98.81,0.51 98.81,72.9 99.31,72.9 99.31,0.51
N$99
  cutout Top: 98.81,1.02 1.02,1.02 1.02,0.51 98.81,0.51
N$100
  cutout Bottom: 98.81,1.02 1.02,1.02 1.02,0.51 98.81,0.51
N$101
  cutout Bottom: 98.81,72.39 1.02,72.39 1.02,72.9 98.81,72.9
N$102
  cutout Top: 98.81,72.39 1.02,72.39 1.02,72.9 98.81,72.9
N$103
  cutout Top: 22.1,23.62 20.57,23.62 20.57,22.61 22.1,22.61
N$104
  cutout Bottom: 22.1,23.62 20.57,23.62 20.57,22.61 22.1,22.61
N$105
  cutout Bottom: 28.96,43.43 27.69,43.43 27.69,41.4 28.96,41.4
N$106
  cutout Top: 28.96,43.43 27.69,43.43 27.69,41.4 28.96,41.4
N$107
  cutout Top: 32.77,8.89 32.77,7.37 36.07,7.37 36.07,8.89
N$108
  cutout Bottom: 32.77,8.89 32.77,7.37 36.07,7.37 36.07,8.89
NRES
  Top 0.406: U1.1 24.64,64.01 25.89,65.26 32.28,65.26 34.8,62.74 R2.P$2
OK
  Top 0.406: 42.42,22.1 J26.1 42.42,22.1 | 42.42,22.1 U2.13
PC
  Bottom 0.406: S4.2 18.29,5.59 24,11.3 24,15.75 19.56,20.19 19.56,22.1 U2.6
POT
  Bottom 0.406: J3.4 J3.3 45.72,72.14 28.96,72.14 U1.7
PPS  (via drill 0.35)
  Top 0.406: J32.1 46.23,10.67 D5.A 47.5,6.86 PPS.1 52.58,4.32 v53.85,3.05 | J35.1 P-1.1
  Bottom 0.406: P-1.1 J35.1 67.82,4.32 66.55,3.05 v53.85,3.05
PWR_LED1
  Bottom 0.406: D2.A 46.48,61.47 47.5,61.47 R4.P$2
PWR_LED2
  Top 0.406: R1.P$2 2.54,67.82 5.08,70.36 D1.A
R  (via drill 0.35)
  Top 0.406: R-1.1 J35.4 | v57.91,18.03 56.64,19.3 52.58,23.37 51.31,23.37 | U2.15 44.96,32.26 47.5,29.72 RX.1 48.77,25.91 51.31,23.37 | 51.31,23.37 J32.4
  Bottom 0.406: J35.4 R-1.1 60.2,15.75 v57.91,18.03
R/GPS
  Top 0.406: U2.12 39.12,22.86 39.12,18.29 41.15,16.26 J31.2
RX
  Top 0.406: J30.3 14.48,17.02 14.48,22.1 U2.2
T  (via drill 0.35)
  Top 0.406: J35.3 T-1.1 | v62.74,13.72 62.74,14.48 61.47,15.75 51.31,15.75 50.04,17.02 J32.3 | 43.69,17.02 J32.3 | J32.3 43.69,17.02 | 43.69,17.02 TX.1
  Bottom 0.406: J35.3 T-1.1 v62.74,13.72 | J32.3 42.42,22.1 U2.14
TX
  Bottom 0.406: J30.2 11.94,17.02 11.94,22.1 U2.3
V+
  Top 1.016: J24.1 J24.2
V-
  Top 1.016: J25.1 J25.2
V_BATT  (via drill 0.35)
  Top 0.508: U2.24 J21.1 | v36.07,44.96 37.34,46.23 J15.1
  Top 1.016: C10.1 C7.1 60.33,59.18 | C10.1 60.2,54.99 60.2,52.58 58.93,51.31 J15.2 J15.1 | 60.33,59.18 60.33,60.05 | J12.1 C10.1 | 60.33,60.05 60.33,59.18 | C4.1 60.33,60.05
  Bottom 0.508: J21.1 23.37,39.88 30.99,39.88 v36.07,44.96
VCC
  Top 0.813: C2.1 67.82,69.09 65.28,66.55 60.2,66.55 58.93,67.82 S1.1
  Top 1.016: J12.3 C11.1 C8.1 69.11,58.78 C2.1
XTAL1
  Top 0.406: U1.3 C6.2 32.26,57.66 Y1.2
XTAL2
  Top 0.406: U1.2 C5.1 24.64,57.66 Y1.1

### Text on the board
tPlace: TIMER | ON | SYSTEM | OFF | JRODRIGUEZ | INT | EN | B- | + | + | ON LED | PROG | V | B+ | B- | G | VCC | GND | DAT | MPX-5*** | I2C | VE000001 | SCL | SD BREAKOUT | SDA | 2 | DAT | GND | CLK | VCC | GND | CMD | CD | 5V | GND | 328-PU | ERROR | ADC | Lithium / Battery / Charger | JRODRIGUEZ | termoDaQ_V1.0 | 11/2017 | GND | V+ | termoDaQ | OK | V- | V1.0 | RX | OFF | TX | BATT | DTR | RX | TX | 5V | CTS | GND | GPS AC | VCC | + | VCC | PROG | GND | DAT | DS18B20 | + | DS18B20 | PPS | AIN | STOP DAQ | GND | GND | DAT | VCC | + | GPS | RESET
bPlace: github.com/mc-ireiser/termoDaQ | termoDaQ_V1.0 | Jesus Alfonso Rodriguez Lista | VE000001
tDocu: termoDaQ [OSHW] VE000001 / By Jesus Alfonso Rodriguez Lista / Is licensed under: / Creative Commons Attribution-ShareAlike 4.0 International Public License